# EAGLE design PogoPins_ICSP (EAGLE 8.3.2)

## Sheet 1 of 2
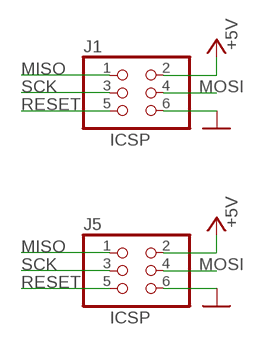
[diagram p0: schematic, sheet 1]

### Parts
J1  PINHD-2X3  [2X03]
J5  PINHD-2X3  [2X03]

### Nets
GND: J1.6 J5.6
MISO: J1.1 J5.1
MOSI: J1.4 J5.4
RESET: J1.5 J5.5
SCK: J1.3 J5.3
VCC_5V: J1.2 J5.2 ; supply symbol labelled +5V

### Notes on the sheet
- ICSP
- ICSP

## Sheet 2 of 2

## Library data of the parts
J1 J5 = analyzer:PINHD-2X3

## Net classes
0 default: width 0.203 mm

## Board
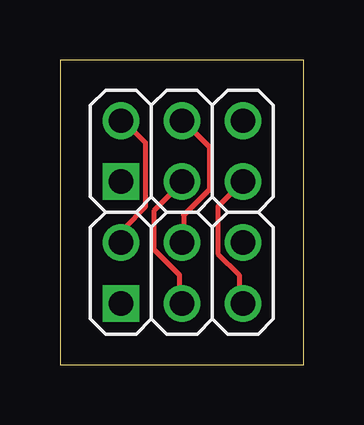
[diagram p1: board, top side]
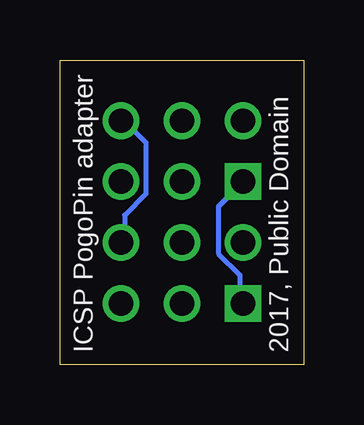
[diagram p2: board, bottom side, seen from below]

Size 10.16 x 12.69 mm. Coordinates in mm from the lower left corner, seen from the top.
Outline: 0,0 10.16,0 10.16,12.69 0,12.69 0,0
Copper layers (1*16): Top 0.035mm / dielectric 1.5mm / Bottom 0.035mm
Design rules "default": minimum track width 6mil, minimum drill 0.35mm, track to track 6mil, track to pad 6mil, pad to pad 6mil, via to via 6mil, smd to smd 6mil, copper to edge 40mil, drill to drill 6mil, minimum pad ring 10mil, minimum via ring 8mil, stop-mask expansion 4mil, vias tented up to drill 0mil, thermal gap 10mil

### Footprints (pad centres in the part's own frame; a part is rotated, then mirrored left to right if it is on the bottom)
2X03 = drill 1.016 square: 1 -2.54,-1.27 | drill 1.016: 2 -2.54,1.27; 3 0,-1.27; 4 0,1.27; 5 2.54,-1.27; 6 2.54,1.27

### Placement (x,y rotation side)
J1  5.08,8.89 0 top
J5  5.08,3.81 0 top

### Tracks (layer width: path | path; a pad name or v marks a point on that pad's centre or on a via)
GND
  Bottom 0.203: J5.6 7.47,5.16 7.47,6.22 6.58,7.11 6.58,9.25 7.47,10.13 J1.6
MISO
  Bottom 0.203: J5.1 2.67,2.67 2.67,3.73 3.56,4.62 3.56,6.58 2.67,7.47 J1.1
MOSI
  Top 0.203: J5.4 5.16,5.16 5.16,6.22 6.22,7.29 6.22,9.07 5.16,10.13 J1.4
RESET
  Top 0.203: J1.5 6.58,6.58 6.58,4.62 7.47,3.73 7.47,2.67 J5.5
SCK
  Top 0.203: J5.3 4.98,2.67 4.98,3.73 3.91,4.8 3.91,6.4 4.98,7.47 J1.3
VCC_5V
  Top 0.203: J5.2 2.67,5.16 2.67,5.69 3.56,6.58 3.56,9.25 2.67,10.13 J1.2

### Text on the board
bPlace: 2017, Public Domain | ICSP PogoPin adapter